# Altium schematic sheet HV_Diffuser.SchDoc: HV Diffuser
size A3; DrawnBy: Jonathan Edwards; Organization: ECE Department; Address1: University of Canterbury; Address2: Christchurch 8041; Address3: New Zealand; Revision: A; SheetNumber: 1; SheetTotal: 2; JobNumber: ENEL PROD
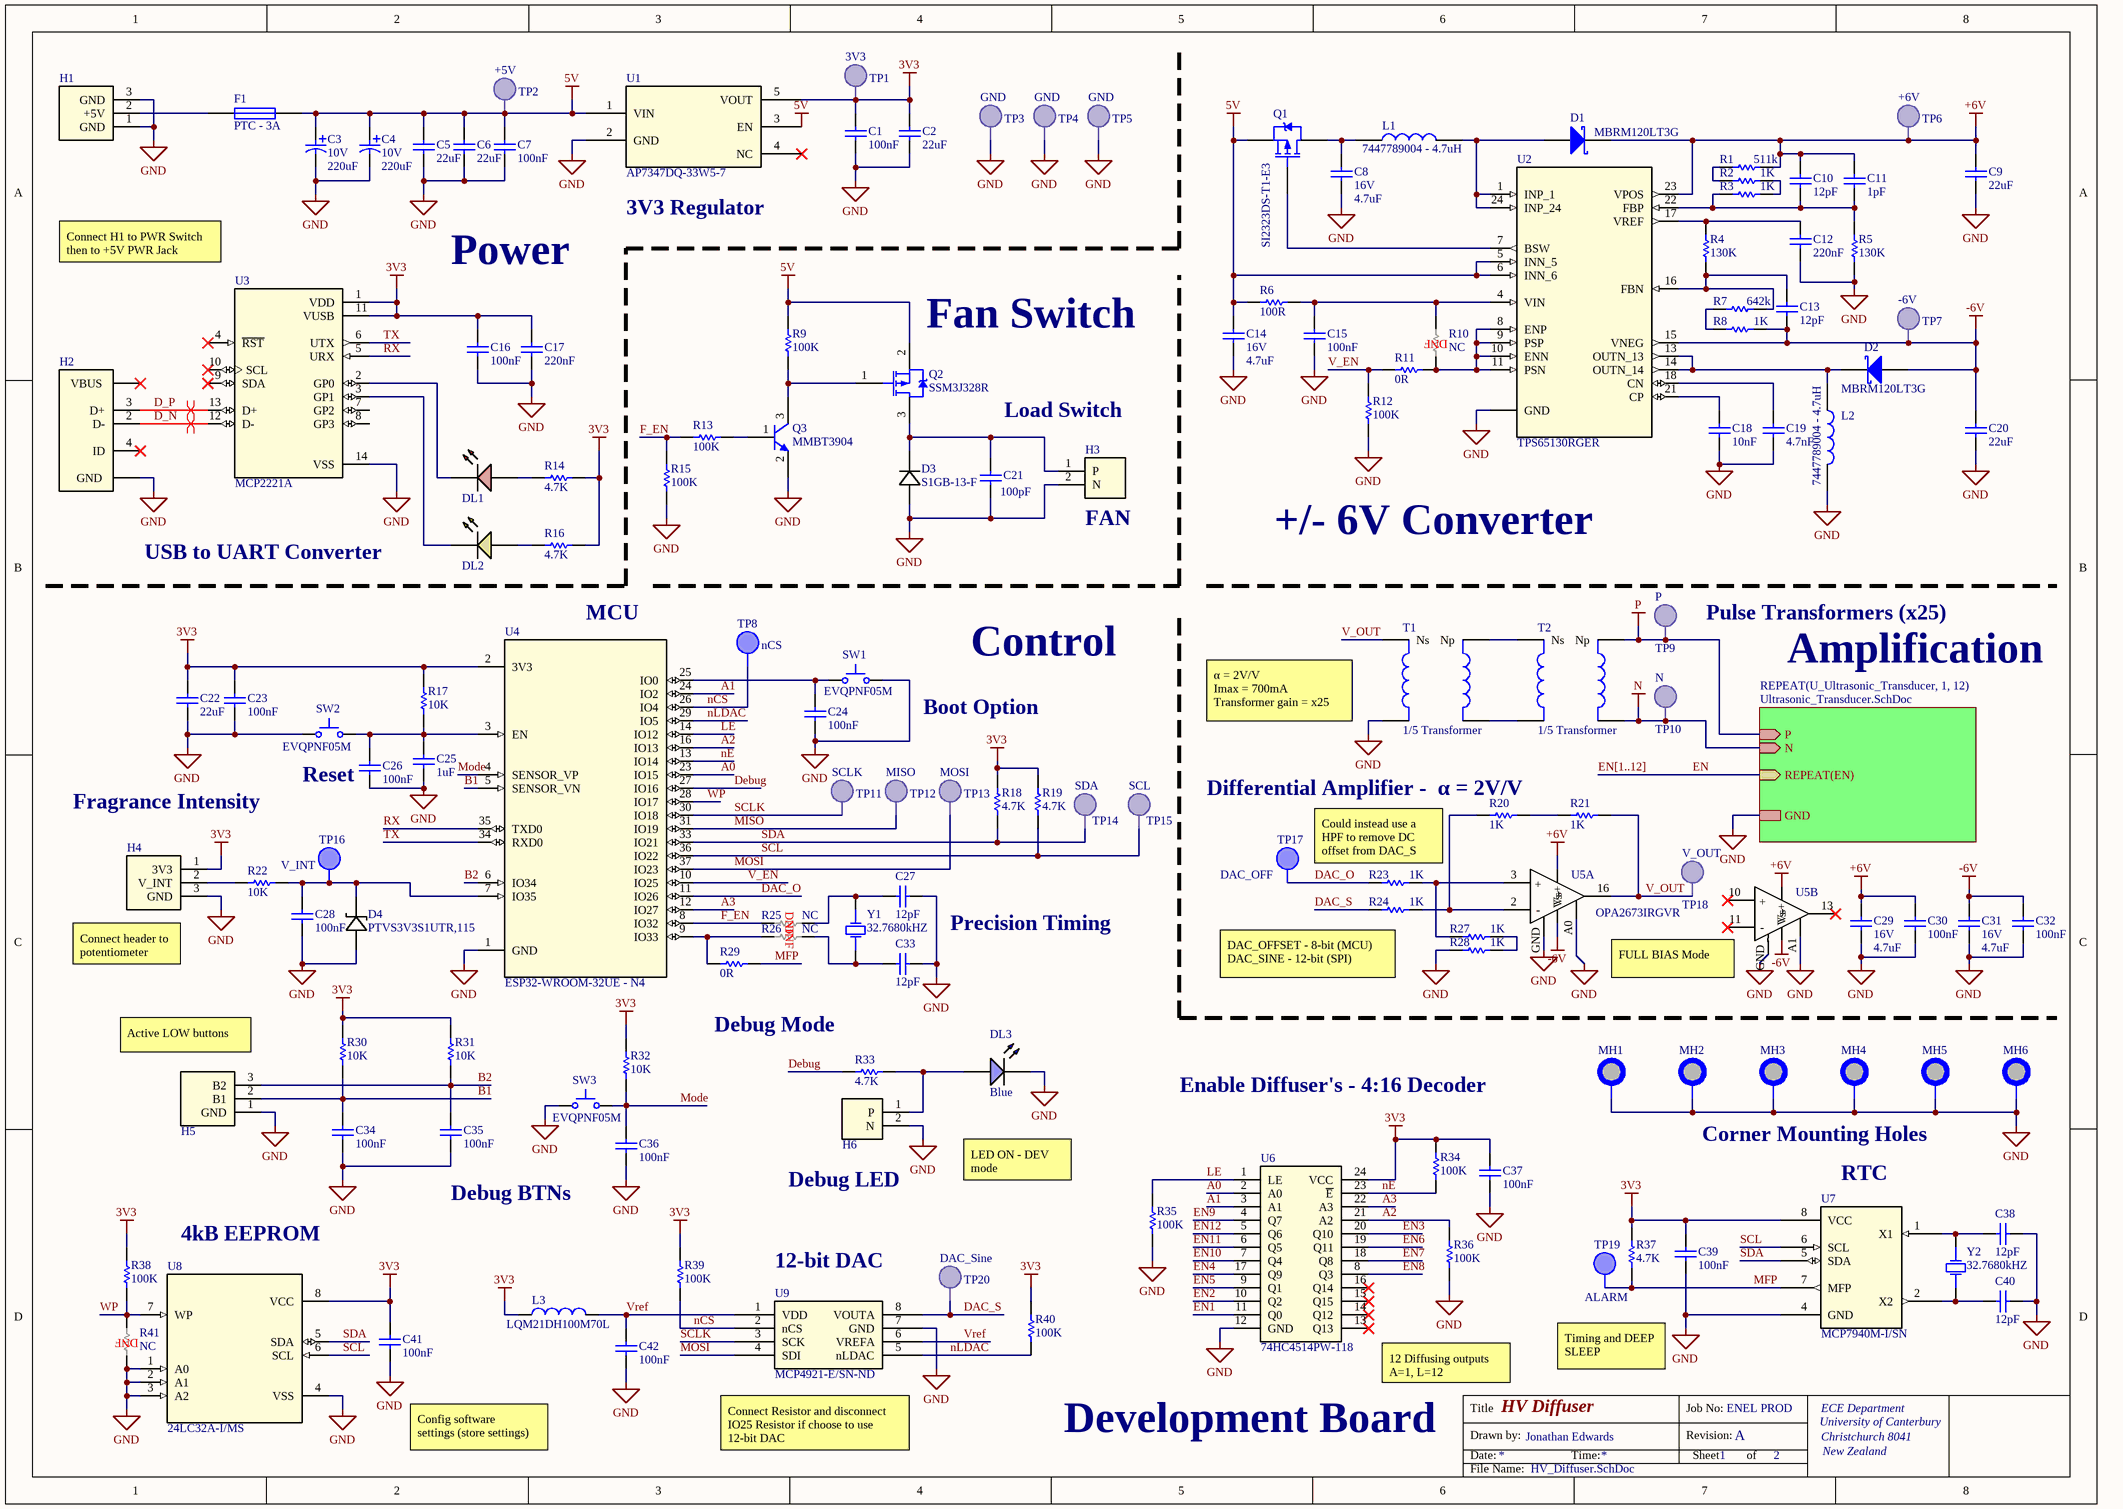
[diagram p0: HV_Diffuser.SchDoc]

## Parts
C1  100nF  [C_0603]
C2  22uF  [C_0805]
C3  Voltage: 10V  [C_2917]  (hidden comment: 220uF)
C4  Voltage: 10V  [C_2917]  (hidden comment: 220uF)
C5  22uF  [C_0805]
C6  22uF  [C_0805]
C7  100nF  [C_0603]
C8  Voltage: 16V  [C_0805]  (hidden comment: 4.7uF)
C9  22uF  [C_0805]
C10  12pF  [C_0603]
C11  1pF  [C_0603]
C12  220nF  [C_0603]
C13  12pF  [C_0603]
C14  Voltage: 16V  [C_0805]  (hidden comment: 4.7uF)
C15  100nF  [C_0603]
C16  100nF  [C_0603]
C17  220nF  [C_0603]
C18  10nF  [C_0603]
C19  4.7nF  [C_0603]
C20  22uF  [C_0805]
C21  100pF  [C_0603]
C22  22uF  [C_0805]
C23  100nF  [C_0603]
C24  100nF  [C_0603]
C25  1uF  [C_0603]
C26  100nF  [C_0603]
C27  12pF  [C_0603]
C28  100nF  [C_0603]
C29  Voltage: 16V  [C_0805]  (hidden comment: 4.7uF)
C30  100nF  [C_0603]
C31  Voltage: 16V  [C_0805]  (hidden comment: 4.7uF)
C32  100nF  [C_0603]
C33  12pF  [C_0603]
C34  100nF  [C_0603]
C35  100nF  [C_0603]
C36  100nF  [C_0603]
C37  100nF  [C_0603]
C38  12pF  [C_0603]
C39  100nF  [C_0603]
C40  12pF  [C_0603]
C41  100nF  [C_0603]
C42  100nF  [C_0603]
D1  MBRM120LT3G  [DO-216AA]
D2  MBRM120LT3G  [DO-216AA]
D3  S1GB-13-F  [DO-214AA, SMB]
D4  PTVS3V3S1UTR,115  [CR_PTVS3V_NEX-M]
DL1  Red  [WL-SMCW0603]  (value not drawn)
DL2  Yellow  [WL-SMCW0603]  (value not drawn)
DL3  Blue  [WL-SMCW0603]
F1  PTC - 3A  [PTC_Fuse_1812]
H1  3 pin - 2mm  [TE_440054-3]  (value not drawn)
H2  JS_USB_MICRO_B  [JS_USB_MICRO_B]  (value not drawn)
H3  2 Pin Male 2mm  [JST_B2B-PH-K-S]  (value not drawn)
H4  3 pin - 2mm  [TE_440054-3]  (value not drawn)
H5  3 pin - 2mm  [TE_440054-3]  (value not drawn)
H6  2 Pin Male 2mm  [JST_B2B-PH-K-S]  (value not drawn)
L1  7447789004 - 4.7uH  [7447789004 - 4.7uH]
L2  7447789004 - 4.7uH  [7447789004 - 4.7uH]
L3  LQM21DH100M70L  [R_0805]
MH1  MH_M2  [MH_M2]  (value not drawn)
MH2  MH_M2  [MH_M2]  (value not drawn)
MH3  MH_M2  [MH_M2]  (value not drawn)
MH4  MH_M2  [MH_M2]  (value not drawn)
MH5  MH_M2  [MH_M2]  (value not drawn)
MH6  MH_M2  [MH_M2]  (value not drawn)
Q1  SI2323DS-T1-E3  [SOT23]
Q2  SSM3J328R  [SOT-23F]
Q3  MMBT3904  [SOT23_NXP-M]
R1  511k  [R_0603]
R2  1K  [R_0603]
R3  1K  [R_0603]
R4  130K  [R_0603]
R5  130K  [R_0603]
R6  100R  [R_0603]
R7  642k  [R_0603]
R8  1K  [R_0603]
R9  100K  [R_0603]
R10  NC  [R_0603_NC]
R11  0R  [R_0603]
R12  100K  [R_0603]
R13  100K  [R_0603]
R14  4.7K  [R_0603]
R15  100K  [R_0603]
R16  4.7K  [R_0603]
R17  10K  [R_0603]
R18  4.7K  [R_0603]
R19  4.7K  [R_0603]
R20  1K  [R_0603]
R21  1K  [R_0603]
R22  10K  [R_0603]
R23  1K  [R_0603]
R24  1K  [R_0603]
R25  NC  [R_0603_NC]
R26  NC  [R_0603_NC]
R27  1K  [R_0603]
R28  1K  [R_0603]
R29  0R  [R_0603]
R30  10K  [R_0603]
R31  10K  [R_0603]
R32  10K  [R_0603]
R33  4.7K  [R_0603]
R34  100K  [R_0603]
R35  100K  [R_0603]
R36  100K  [R_0603]
R37  4.7K  [R_0603]
R38  100K  [R_0603]
R39  100K  [R_0603]
R40  100K  [R_0603]
R41  NC  [R_0603_NC]
SW1  EVQPNF05M  [Tactile Switche - EVQPNF05M]
SW2  EVQPNF05M  [Tactile Switche - EVQPNF05M]
SW3  EVQPNF05M  [Tactile Switche - EVQPNF05M]
T1  1/5 Transformer  [PMT9085NL]
T2  1/5 Transformer  [PMT9085NL]
TP1  3V3  [TP_1206]  (no BOM)
TP2  +5V  [TP_1206]  (no BOM)
TP3  GND  [TP_1206]  (no BOM)
TP4  GND  [TP_1206]  (no BOM)
TP5  GND  [TP_1206]  (no BOM)
TP6  +6V  [TP_1206]  (no BOM)
TP7  -6V  [TP_1206]  (no BOM)
TP8  nCS  [TP-Small]
TP9  P  [TP_1206]  (no BOM)
TP10  N  [TP_1206]  (no BOM)
TP11  SCLK  [TP_1206]  (no BOM)
TP12  MISO  [TP_1206]  (no BOM)
TP13  MOSI  [TP_1206]  (no BOM)
TP14  SDA  [TP_1206]  (no BOM)
TP15  SCL  [TP_1206]  (no BOM)
TP16  V_INT  [TP-Small]
TP17  DAC_OFF  [TP-Small]
TP18  V_OUT  [TP_1206]  (no BOM)
TP19  ALARM  [TP-Small]
TP20  DAC_Sine  [TP_1206]  (no BOM)
U1  AP7347DQ-33W5-7  [SOT25-A1_DIO-M]
U2  TPS65130RGER  [QFN50P400X400X100-25N]
U3  MCP2221A  [14-SOIC]
U4  ESP32-WROOM-32UE - N4  [MODULE_ESP32-WROOM-32UE(M113EH6400UH3Q0)]
U5  OPA2673IRGVR  [RGV16_2P16X2P16]  (parts A,B of 2)
U6  74HC4514PW-118  [SOP65P640X110-24N]
U7  MCP7940M-I/SN  [SOIC8-N_MC_MCH]
U8  24LC32A-I/MS  [SOP65P490X110-8N]
U9  MCP4921-E/SN-ND  [8-SOIC - DAC]
Y1  32.7680kHZ  [XTAL_MS1V-T1K-32.768KHZ-9PF-20PPM-TA-QC-AU]
Y2  32.7680kHZ  [XTAL_MS1V-T1K-32.768KHZ-9PF-20PPM-TA-QC-AU]

## Sub-sheets
REPEAT(U_Ultrasonic_Transducer, 1, 12) = Ultrasonic_Transducer.SchDoc: REPEAT(EN) (in), GND, P (in), N (in)

## Nets
3V3: C1.2 C2.2 C16.2 C17.1 C22.2 C23.2 C37.2 C39.2 C41.2 H4.1(3V3) L3.1 R14.1 R16.1 R17.1 R18.2 R19.2 R30.2 R31.2 R32.2 R34.2 R37.2 R38.2 R39.2 R40.2 TP1.1 U1.5(VOUT) U3.1(VDD) U3.11(VUSB) U4.2(3V3) U6.24(VCC) U7.8(VCC) U8.8(VCC)
5V: C3.1 C4.1 C5.2 C6.2 C7.2 C14.2 F1.2 Q1.2(S) Q2.2 R6.2 R9.1 TP2.1 U1.1(VIN) U1.3(EN) U2.5(INN_5) U2.6(INN_6)
+6V: C9.2 C10.2 C11.2 C29.2 C30.2 D1.1(K) R1.1 TP6.1 U2.23(VPOS) U5.14(Vs+)
-6V: C13.1 C20.2 C31.2 C32.2 D2.2(A) R8.1 TP7.1 U2.15(VNEG) U5.7(Vs-)
GND: C1.1 C2.1 C3.2 C4.2 C5.1 C6.1 C7.1 C8.1 C9.1 C12.2 C14.1 C15.1 C16.1 C17.2 C18.1 C19.1 C20.1 C21.1 C22.1 C23.1 C24.1 C25.1 C26.1 C27.1 C28.1 C29.1 C30.1 C31.1 C32.1 C33.1 C34.1 C35.1 C36.1 C37.1 C38.1 C39.1 C40.1 C41.1 C42.1 D3.2 D4.2 DL3.1(K) H1.1(GND) H1.3(GND) H2.GND H3.2(N) H4.3(GND) H5.1(GND) H6.2(N) L2.1 MH1.1 MH2.1 MH3.1 MH4.1 MH5.1 MH6.1 Q3.2 R5.2 R12.1 R15.2 R28.2 R35.1 R36.1 R41.1 SW1.2 SW2.1 SW3.1 T1.4 TP3.1 TP4.1 TP5.1 U1.2(GND) U2.25(GND) U3.14(VSS) U4.1(GND) U5.A0 U5.A1 U5.GND U6.12(GND) U7.4(GND) U8.1(A0) U8.2(A1) U8.3(A2) U8.4(VSS) U9.7(GND) ; sheet REPEAT(U_Ultrasonic_Transducer, 1, 12)/GND
N: T2.3 TP10.1 ; sheet REPEAT(U_Ultrasonic_Transducer, 1, 12)/N
P: T2.1(Np) TP9.1 ; sheet REPEAT(U_Ultrasonic_Transducer, 1, 12)/P
A0: U4.23(IO15) U6.2(A0)
A1: U4.24(IO2) U6.3(A1)
A2: R36.2 U4.16(IO13) U6.21(A2)
A3: U4.12(IO27) U6.22(A3)
B1: C34.2 H5.2(B1) R30.1 U4.5(SENSOR_VN)
B2: C35.2 H5.3(B2) R31.1 U4.6(IO34)
D_N: H2.2(D-) U3.12(D-)
D_P: H2.3(D+) U3.13(D+)
DAC_O: R23.2 TP17.1 U4.11(IO26)
DAC_S: R24.2 TP20.1 U9.8(VOUTA)
Debug: R33.2 U4.27(IO16)
EN: sheet REPEAT(U_Ultrasonic_Transducer, 1, 12)/REPEAT(EN)
EN1: U6.11(Q0)
EN2: U6.10(Q2)
EN3: U6.20(Q10)
EN4: U6.17(Q9)
EN5: U6.9(Q1)
EN6: U6.19(Q11)
EN7: U6.18(Q8)
EN8: U6.8(Q3)
EN9: U6.4(Q7)
EN10: U6.7(Q4)
EN11: U6.6(Q5)
EN12: U6.5(Q6)
F_EN: R13.2 R15.1 R25.2 U4.8(IO32)
LE: R35.2 U4.14(IO12) U6.1(LE)
MFP: R29.2 R37.1 TP19.1 U7.7(MFP)
MISO: TP12.1 U4.31(IO19)
Mode: C36.2 R32.1 SW3.2 U4.4(SENSOR_VP)
MOSI: TP13.1 U4.37(IO23) U9.4(SDI)
nCS: R39.1 TP8.1 U4.26(IO4) U9.2(nCS)
nE: R34.1 U4.13(IO14) U6.23(~{E})
nLDAC: R40.1 U4.29(IO5) U9.5(nLDAC)
RX: U3.5(URX) U4.35(TXD0)
SCL: R19.1 TP15.1 U4.36(IO22) U7.6(SCL) U8.6(SCL)
SCLK: TP11.1 U4.30(IO18) U9.3(SCK)
SDA: R18.1 TP14.1 U4.33(IO21) U7.5(SDA) U8.5(SDA)
TX: U3.6(UTX) U4.34(RXD0)
V_EN: R11.2 R12.2 U4.10(IO25)
V_OUT: R21.1 T1.6(Ns) TP18.1 U5.16(OUTA)
Vref: C42.2 L3.2 U9.1(VDD) U9.6(VREFA)
WP: R38.1 R41.2 U4.28(IO17) U8.7(WP)
NetC8_2: C8.2 L1.1 Q1.3(D)
NetC10_1: C10.1 C11.1 R3.2 R5.1 U2.22(FBP)
NetC12_1: C12.1 R4.1 U2.17(VREF)
NetC13_2: C13.2 R4.2 R7.1 U2.16(FBN)
NetC15_2: C15.2 R6.1 R10.2 U2.4(VIN)
NetC18_2: C18.2 U2.21(CP)
NetC19_2: C19.2 U2.18(CN)
NetC21_2: C21.2 D3.1 H3.1(P) Q2.3
NetC24_2: C24.2 SW1.1 U4.25(IO0)
NetC25_2: C25.2 C26.2 R17.2 SW2.2 U4.3(EN)
NetC27_2: C27.2 R25.1 Y1.1
NetC28_2: C28.2 D4.1 R22.2 TP16.1 U4.7(IO35)
NetC33_2: C33.2 R26.1 Y1.2
NetC38_2: C38.2 U7.1(X1) Y2.2
NetC40_2: C40.2 U7.2(X2) Y2.1
NetD1_2: D1.2(A) L1.2 U2.1(INP_1) U2.24(INP_24)
NetD2_1: D2.1(K) L2.2 U2.13(OUTN_13) U2.14(OUTN_14)
NetDL1_1: DL1.1(K) U3.2(GP0)
NetDL1_2: DL1.2(A) R14.2
NetDL2_1: DL2.1(K) U3.3(GP1)
NetDL2_2: DL2.2(A) R16.2
NetDL3_2: DL3.2(A) H6.1(P) R33.1
NetF1_1: F1.1 H1.2(+5V)
NetH4_2: H4.2(V_INT) R22.1
NetQ1_1: Q1.1(G) U2.7(BSW)
NetQ2_1: Q2.1 Q3.3 R9.2
NetQ3_1: Q3.1 R13.1
NetR1_2: R1.2 R2.2
NetR2_1: R2.1 R3.1
NetR7_2: R7.2 R8.2
NetR10_1: R10.1 R11.1 U2.8(ENP) U2.9(PSP) U2.10(ENN) U2.11(PSN)
NetR20_1: R20.1 R21.2
NetR20_2: R20.2 R24.1 U5.2(IN-)
NetR23_1: R23.1 R27.2 U5.3(IN+)
NetR26_2: R26.2 R29.1 U4.9(IO33)
NetR27_1: R27.1 R28.1
NetT1_1: T1.1(Np) T2.6(Ns)
NetT1_3: T1.3 T2.4

Not connected (* = marked no-connect by the designer): H2 1(VBUS)* 4(ID)*; U1 4(NC)*; U3 4(~{RST})* 7(GP2) 8(GP3) 9(SDA)* 10(SCL)*; U5 10(IN+)* 11(IN-)* 13(OUTA)*; U6 13(Q13)* 14(Q12)* 15(Q15)* 16(Q14)*

## Buses and harness runs
bus EN[1..12]

## Layout directives
differential pair: D_N, D_P

## Notes on the sheet
- (near U1) 3V3 Regulator
- (near U3) Connect H1 to PWR Switch then to +5V PWR Jack
- Power
- (near Q2) Fan Switch
- Load Switch
- USB to UART Converter
- (near H3) FAN
- +/- 6V Converter
- MCU
- (near TP9) Pulse Transformers (x25)
- Boot Option
- Control
- α = 2V/V
  Imax = 700mA
  Transformer gain = x25
- Amplification
- (near C26) Reset
- Fragrance Intensity
- Differential Amplifier -  α = 2V/V
- Could instead use a HPF to remove DC offset from DAC_S
- (near H4) Connect header to potentiometer
- Precision Timing
- (near R24) DAC_OFFSET - 8-bit (MCU)  DAC_SINE - 12-bit (SPI)
- (near U5) FULL BIAS Mode
- (near H5) Active LOW buttons
- Debug Mode
- Enable Diffuser's - 4:16 Decoder
- (near H6) Debug LED
- LED ON - DEV mode
- Corner Mounting Holes
- (near U7) RTC
- 4kB EEPROM
- (near C35) Debug BTNs
- (near U9) 12-bit DAC
- (near U6) 12 Diffusing outputs A=1, L=12
- Timing and DEEP SLEEP
- Config software
  settings (store settings)
- (near U9) Connect Resistor and disconnect IO25 Resistor if choose to use 12-bit DAC
- Development Board
- Title
- Drawn by:
- Date:
- Time:
- Revision:
- Job No:
- Sheet
- of
- File Name:
- (in symbol OPA2673IRGVR, part A) +; -
- (in symbol OPA2673IRGVR, part B) +; -
- (in symbol RS_NC) DNF

## Library data of the parts
C1 C7 C15 C16 C18 C23 C24 C26 C28 C30 C32 C34-C37 C39 C41 C42 = CC_100nF: CAP CER 0.1uF 50V X7R 0603; PackageReference: 0603
  C1 C7 C16 C23 C24 C26 C28 C34-C37 C39 C41 C42: Website: https://www.digikey.co.nz/product-detail/en/samsung-electro-mechanics/CL10B104KB8NFNC/1276-1934-1-ND/3890020; Cost: 0.16; Value: 100nF
  C15 C30 C32: Website: https://www.digikey.co.nz/product-detail/en/samsung-electro-mechanics/CL10B104KB8NFNC/1276-1934-1-ND/3890020; Value: 100nF
  C18: Website: https://www.digikey.co.nz/en/products/detail/samsung-electro-mechanics/CL10B103KB8NNNC/3886667; Value: 10nF
C2 C5 C6 C9 C20 C22 = CC_22uF: CAP CER 22UF 10V X5R 0805; PackageReference: 0805; Website: https://www.digikey.co.nz/en/products/detail/samsung-electro-mechanics/CL21A226MOQNNNE/3888567; Value: 22uF
C3 C4 = CC_100uF: 100 µF Molded Tantalum Capacitors 16 V 2917 (7343 Metric) 75mOhm; Component: T498X107K016ATE075 or T494D227M010AT; Value: 220uF
C8 C14 C29 C31 = CC_4.7uF_50V: 4.7 µF ±10% 50V Ceramic Capacitor X7R 0805 (2012 Metric); Component: CGA4J3X7R1C475K125AE; Value: 4.7uF
C10 C12 C13 C17 C27 C33 C38 C40 = CC_220nF: CAP CER 0.220uF 50V X7R 0603; PackageReference: 0603
  C10 C13 C27 C33 C38 C40: Website: https://www.digikey.co.nz/en/products/detail/kemet/C0603C120C5GAC7867/2199823; Value: 12pF
  C12 C17: Website: https://www.digikey.co.nz/en/products/detail/samsung-electro-mechanics/CL10B224KB8VPNC/5961084; Cost: 0.16; Value: 220nF
C11 = CC_220nF: CAP CER 1pF 50V X7R 0603; PackageReference: 0603; Website: https://www.digikey.co.nz/en/products/detail/yageo/AC0603BRNPO9BN1R0/6643061; Value: 1pF
C19 = CC_4.7nF: CAP CER 4.7nF 50V X7R 0603; PackageReference: 0603; Website: https://www.digikey.co.nz/product-detail/en/samsung-electro-mechanics/CL10B472KB8NFNC/1276-2064-1-ND/3890150; Value: 4.7nF
C21 = CC_100pF: CAP CER 100pF 50V C0G/NP0 0603; PackageReference: 0603; Voltage: 50V; Value: 100pF; Website: https://www.digikey.co.nz/en/products/detail/samsung-electro-mechanics/CL10C101JB81PNC/3887820
C25 = CC_1uF: CAP CER 1uF 16V X7R 0603; PackageReference: 0603; Website: https://www.digikey.co.nz/product-detail/en/samsung-electro-mechanics/CL10B105KO8NFNC/1276-1943-1-ND/3890029; Cost: 0.16; Value: 1uF
D1 D2 = MBRM120LT3G: Diode 20 V 1A Surface Mount Powermite; Mfr_Name: onsemi; Type: DEV; Copyright: Copyright (C) 2024 Ultra Librarian. All rights reserved.; Manufacturer_Part_Number: MBRM120LT3G; RefDes: RefDes
D3 = S1GB-13-F: Diode 400 V 1A Surface Mount SMB
D4 = PTVS3V3S1UTR,115: 8V Clamp 43.8A Ipp Tvs Diode Surface Mount SOD-123W; Mfr_Name: Nexperia; Type: DEV; Copyright: Copyright (C) 2023 Ultra Librarian. All rights reserved.; Manufacturer_Part_Number: PTVS3V3S1UTR,115; Digi-Key_Part_Number_1: 1727-1416-2-ND; Digi-Key_Part_Number_2: 1727-1416-1-ND; Digi-Key_Part_Number_3: 1727-1416-6-ND; RefDes: RefDes
DL1 = Leds - 150060RS75000: LED Red 250mcd 0603 SMD; Cost: 0.25; Website: https://www.digikey.co.nz/product-detail/en/w%C3%BCrth-elektronik/150060RS75000/732-4978-1-ND/4489899
DL2 = Leds - 150060YS75000: LED Yellow 120mcd 0603 SMD; Cost: 0.25; Website: https://www.digikey.co.nz/product-detail/en/w%C3%BCrth-elektronik/150060YS75000/732-4981-1-ND/4489907
DL3 = Leds - 150060BS75000: LED Blue 270mcd 0603 SMD; Cost: 0.25; Website: https://www.digikey.co.nz/product-detail/en/w%C3%BCrth-elektronik/150060BS75000/732-4966-1-ND/4489893; LED Colour: Blue
F1 = FS_PTC_Fuse_3A: PTC RESET FUSE 3.0A 24V 1812; Website: https://www.digikey.co.nz/product-detail/en/littelfuse-inc/1812L300-24SLER/18-1812L300-24SLERCT-ND/12807142; Cost: 3.44; Value: PTC - 3A
H1 H4 H5 = 440054-3: 2.0MM,HDR,3POS,VERTICAL; Product_Type: Connector; Centerline_Pitch: 2 mm[.079 in]; Number_of_Positions: 3; MF: TE Connectivity; Package: None; Availability: Unavailable; TE_purchase_URL: https://www.te.com/usa-en/product-440054-3.html?te_bu=Cor&te_type=disp&te_campaign=seda_glo_cor-seda-global-disp-prtnr-fy19-seda-model-bom-cta_sma-317_1&elqCampaignId=32493; MP: 440054-3; Value: *; EU_RoHS_Compliance: Compliant; SnapEDA_Link: https://www.snapeda.com/parts/440054-3/TE%20Connectivity%20AMP%20Connectors/view-part/942515/?ref=snap; Price: None
H2 = JS_USB_MICRO_B_SMT: CONN USB MICRO B RECPT SMT R/A; Manufacturer: FCI; Manufacturer Part Number: 10118194-0001LF; Gender: Receptacle; Number of Contacts: 5; Specifications: USB 2.0; Supplier 1: Digi-Key; Supplier Part Number 1: 609-4618-1-ND; Features: Shielded, Solder Retention; Mounting Type: Surface Mount, Right Angle, Horizontal; Website: https://www.digikey.co.nz/product-detail/en/10118194-0001LF/609-4618-1-ND/2785382?utm_campaign=buynow&utm_medium=aggregator&curr=nzd&utm_source=octopart; Cost: 0.69
H3 H6 = 2 Pin Male 2mm: CONN HDR 2POS 0.1 TIN PCB
L1 L2 = 7447789004 - 4.7uH: 4.7 µH Shielded Drum Core, Wirewound Inductor 2.9 A 35mOhm Max Nonstandard
L3 = 10uH - LQM21DH100M70L: Inductor with Inductance: 10uH Tol. +/-20%, Package: 0805 (2012); Cost: 0.43; Website: https://www.digikey.co.nz/products/en?keywords=490-18463-1-ND
MH1-MH6 = MH_M2: Mounting Holes
Q1 = SI2323DS-T1-E3: P-Channel 20V 3.7A _Ta_ 750mW _Ta_ Surface Mount SOT-23-3 _TO-236_; MF: Vishay Siliconix; Value: *; Availability: Unavailable; Package: SOT-23-3 Vishay; Price: None; SnapEDA_Link: https://www.snapeda.com/parts/SI2323DS-T1-E3/Vishay%20Siliconix/view-part/1098076/?ref=snap; MP: SI2323DS-T1-E3
Q2 = P Mos - SSM3J328R: MOSFET P-CH 20V 6A SOT23F; Cost: 0.68; Website: https://www.digikey.co.nz/product-detail/en/toshiba-semiconductor-and-storage/SSM3J328R-LF/SSM3J328RLFCT-ND/2753207
Q3 = NPN - MMBT3904: TRANS NPN 40V 200MA TO236AB; Manufacturer: NXP; Cost: 0.17; Website: https://www.digikey.co.nz/product-detail/en/nexperia-usa-inc/MMBT3904-215/1727-4044-1-ND/1944320; Value: MMBT3904
R1 = RS_100K: RES 512K OHM 0.1% 1/10W 0603; Website: https://www.digikey.co.nz/en/products/detail/te-connectivity-passive-product/RP73D1J511KBTDF/14007424; Value: 511k
R2 R3 R8 = RS_1K: RES 1K OHM 0.1% 1/10W 0603; Website: https://www.digikey.co.nz/en/products/detail/koa-speer-electronics-inc/RN73H1JTTD1001B50/10686361; Value: 1K
R4 R5 = RS_1K: RES 130K OHM 0.1% 1/10W 0603; Website: https://www.digikey.co.nz/en/products/detail/susumu/RG1608P-134-B-T5/1240479; Value: 130K
R6 = RS_0R: 100 Ohms ±0.1% 0.167W, 1/6W Chip Resistor 0603 (1608 Metric) Thin Film; Website: https://www.digikey.co.nz/en/products/detail/te-connectivity-passive-product/RP73PF1J100RBTDF/4033480; Value: 100R
R7 R9 R12 R13 R15 R34-R36 R38-R40 = RS_100K: RES 100K OHM 1% 1/10W 0603
  R7: Website: https://www.digikey.co.nz/en/products/detail/koa-speer-electronics-inc/RN73H1JTTD6423B50/10678200; Value: 642k
  R9 R12 R13 R15 R34-R36 R38-R40: Cost: 0.16; Website: https://www.digikey.co.nz/product-detail/en/yageo/RC0603FR-07100KL/311-100KHRCT-ND/729836; Value: 100K
R10 R25 R26 R41 = RS_NC: NC - 0603; Value: NC
R11 R29 = RS_0R: RES SMD 0 OHM JUMPER 1/10W 0603; Cost: 0.16; Website: https://www.digikey.co.nz/product-detail/en/yageo/RC0603FR-070RL/311-0-0HRCT-ND/4340584; Value: 0R
R14 R16 R18 R19 R33 R37 = RS_4.7K: RES SMD 4.7K OHM 1% 1/10W 0603; Value: 4.7K
R17 R22 R30-R32 = RS_10K: RES SMD 10K OHM 1% 1/10W 0603; Cost: 0.16; Website: https://www.digikey.co.nz/product-detail/en/yageo/RC0603FR-0710KL/311-10-0KHRCT-ND/729827; Value: 10K
R20 R21 R23 R24 R27 R28 = RS_1K: RES 1K OHM 1% 1/10W 0603; Cost: 0.16; Website: https://www.digikey.co.nz/product-detail/en/yageo/RC0603FR-071KL/311-1-00KHRCT-ND/729790; Supplier Part Number 1: 311-1.00KHRCT-ND; Supplier 1: Digi-Key; Value: 1K
SW1-SW3 = Tactile Switch - WS_EVQPNF05M: Panasonic 6 x 3.5mm SMD Light Touch Switch Type SMD; PackageDescription: 6.0 x 3.5 mm; Supplier 1: Farnell; Supplier Part Number 1: 2079481; Manufacturer: Panasonic; Manufacturer PN: EVQPNF05M; Supplier 2: Digi-Key; Supplier Part Number 2: P13598SCT-ND; Storage Location: PCB Assembly WS; Supplier: ECE Dept; Cost: 0.87; Website: https://www.digikey.co.nz/product-detail/en/panasonic-electronic-components/EVQ-PNF05M/P13598SCT-ND/1245519
T1 T2 = PMT9085NL: 160µH Gate Drive Pulse Transformer 1CT:5CT Surface Mount
TP1-TP7 TP9-TP15 TP18 TP20 = TP_1206: TP, 325mm x 1.65mm); Manufacturer: Harwin Inc; Manufacturer Part Number: S1751-46R; Use: (SPI, I2C, PWM); Manufacturer PN: *; Storage Location: ProtoPlace; Mounting Type: Surface Mount; Type: PC Test Point; Supplier 1: Digi-Key; Supplier Part Number 1: 952-1478-2-ND; Supplier 2: Farnell; Supplier Part Number 2: 1826282; Supplier: ECE Dept; Value: TP; Website: https://www.digikey.co.nz/product-detail/en/harwin-inc/S1751-46R/952-1478-1-ND/2264564; Cost: 0.44
TP8 TP16 TP17 TP19 = TP-Small: Use for basic signals
U1 = AP7347DQ-33W5-7: Linear Voltage Regulator IC Positive Fixed 1 Output 500mA SOT-25; Mfr_Name: Diodes Inc; Type: DEV; Copyright: Copyright (C) 2024 Ultra Librarian. All rights reserved.; Manufacturer_Part_Number: AP7347DQ-33W5-7; RefDes: RefDes
U2 = TPS65130RGER: Boost, Buck-Boost Switching Regulator IC Positive and Negative (Dual Rail) Adjustable 3.2V, -2V 2 Output 700mA (Switch) 24-VFQFN Exposed Pad; Price: None; Package: None; Availability: Unavailable; MP: TPS65130RGER; Value: *
U3 = USB Serial - MCP2221A-I/ST: USB Bridge, USB to I2C/UART USB 2.0 I2C, UART Interface 14-SOIC; Cost: 3.64; Website: https://www.digikey.co.nz/product-detail/en/microchip-technology/MCP2221A-I-SL/MCP2221A-I-SL-ND/6009297; Backup - QFN: https://www.digikey.co.nz/product-detail/en/microchip-technology/MCP2221A-I-ML/MCP2221A-I-ML-ND/6009295
U4 = ESP32-WROOM-32UE(M113EH6400UH3Q0): Bluetooth, WiFi 802.11b/g/n, Bluetooth v4.2 +EDR, Class 1, 2 and 3 Transceiver Module 2.4GHz ~ 2.5GHz Antenna Not Included, U.FL Surface Mount; MF: Espressif Systems; Price: None; Check_prices: https://www.snapeda.com/parts/ESP32-WROOM-32UE(M113EH6400UH3Q0)/Espressif+Systems/view-part/?ref=eda; Value: *; Package: None; SnapEDA_Link: https://www.snapeda.com/parts/ESP32-WROOM-32UE(M113EH6400UH3Q0)/Espressif+Systems/view-part/?ref=snap; MP: ESP32-WROOM-32UE(M113EH6400UH3Q0); Availability: Not in stock
U5 = OPA2673IRGVR: Current Feedback Amplifier 2 Circuit 16-VQFN (4x4); Mfr_Name: Texas Instruments; Copyright: Copyright (C) 2024 Ultra Librarian. All rights reserved.; Manufacturer_Part_Number: OPA2673IRGVR; RefDes: RefDes; Type: DEV
U6 = 74HC4514PW-118: 74HC(T)4514 - 4-to-16 line decoder/demultiplexer with input latches@en-us; Manufacturer_Name: Nexperia; Manufacturer_Part_Number: 74HC4514PW,118; Geometry.Height: 1.1mm; Mouser Part Number: 771-HC4514PW118; Mouser Price/Stock: https://www.mouser.co.uk/ProductDetail/Nexperia/74HC4514PW118?qs=P62ublwmbi%2F4NHTNGiPEGA%3D%3D; Datasheet Link: https://assets.nexperia.com/documents/data-sheet/74HC_HCT4514.pdf
U7 = MCP7940M-ISN: Real Time Clock (RTC) IC Clock/Calendar 64B I2C, 2-Wire Serial 8-SOIC (0.154", 3.90mm Width); Mfr_Name: Microchip; Copyright: Copyright (C) 2024 Ultra Librarian. All rights reserved.; Manufacturer_Part_Number: MCP7940M-I/SN; RefDes: RefDes; Type: DEV
U8 = 24LC32A-I/MS: EEPROM Memory IC 32Kb _4K x 8_ IÂ²C 400kHz 900ns 8-MSOP; MF: Microchip; MP: 24LC32A-I/MS; Package: MSOP-8 Microchip; Price: None; Availability: Unavailable; SnapEDA_Link: https://www.snapeda.com/parts/24LC32A-I/MS/Microchip/view-part/138508/?ref=snap; Value: *
U9 = MCP4921: 12 Bit Digital to Analog Converter 1 8-SOIC; Mfr_Name: Microchip; Manufacturer_Part_Number: MCP4822T-E/SN; Copyright: Copyright (C) 2024 Ultra Librarian. All rights reserved.; RefDes: RefDes; Type: DEV
Y1 Y2 = 32.7680kHZ: 32.768 kHz ±20ppm Crystal 9pF 60 kOhms Cylindrical Can, Radial; MP: MS1V-T1K-32.768KHZ-9PF-20PPM-TA-QC-AU; MF: Micro Crystal AG; SnapEDA_Link: https://www.snapeda.com/parts/MS1V-T1K-32.768KHZ-9PF-20PPM-TA-QC-AU/Micro+Crystal/view-part/?ref=snap; Value: *; Check_prices: https://www.snapeda.com/parts/MS1V-T1K-32.768KHZ-9PF-20PPM-TA-QC-AU/Micro+Crystal/view-part/?ref=eda; Purchase-URL: https://pricing.snapeda.com/search/part/MS1V-T1K-32.768KHZ-9PF-20PPM-TA-QC-AU/?ref=eda; Package: SMD-3 Micro Crystal